# EAGLE schematic ECG_Circuit (EAGLE 8.5.0)
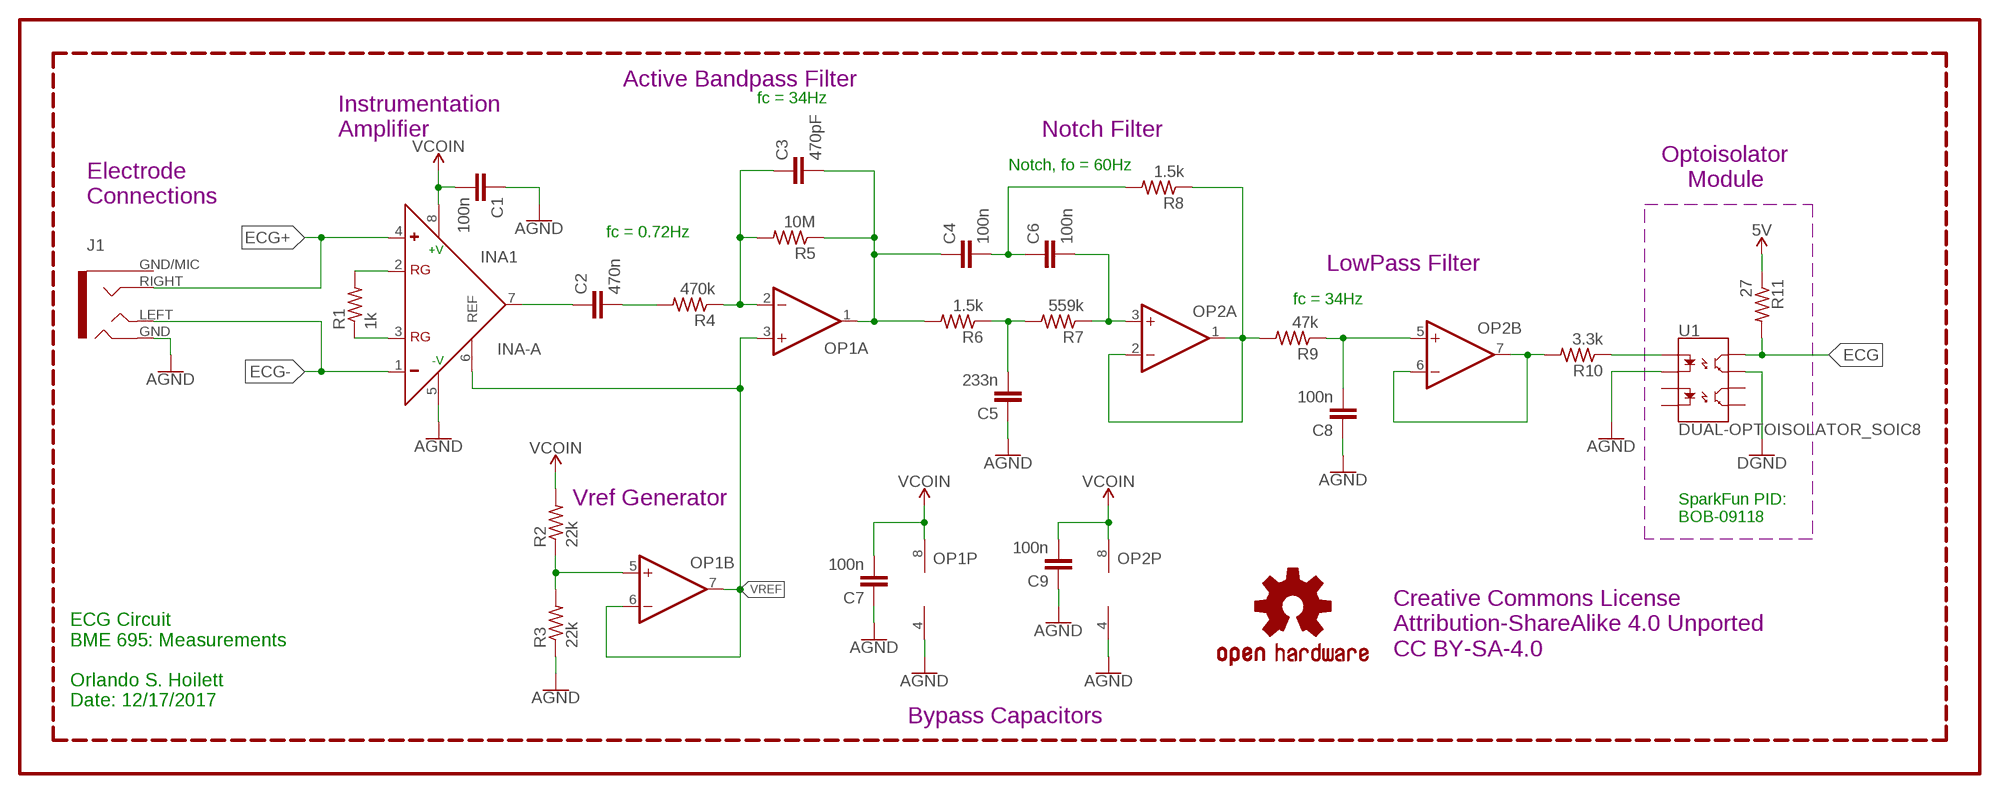
[diagram p0: schematic, sheet 1]

## Parts
C1  100n  CAPACITOR0402  [C0402]
C2  470n  CAPACITOR0402  [C0402]
C3  470pF  CAPACITOR0402  [C0402]
C4  100n  CAPACITOR0402  [C0402]
C5  233n  CAPACITOR0402  [C0402]
C6  100n  CAPACITOR0402  [C0402]
C7  100n  CAPACITOR0402  [C0402]
C8  100n  CAPACITOR0402  [C0402]
C9  100n  CAPACITOR0402  [C0402]
INA1  INA-A  [MSOP08]
J1  AUDIO_JACK_TRRSSMD_RA  [AUDIO_JACK_3.5MM_TRRS_SMD_RA]
LOGO1  OSHW-LOGOS  [OSHW-LOGO-S]
OP1  OP-DUALRM  [MSOP08]
OP2  OP-DUALRM  [MSOP08]
R1  1k  RESISTOR0402  [R0402]
R2  22k  RESISTOR0402  [R0402]
R3  22k  RESISTOR0402  [R0402]
R4  470k  RESISTOR0402  [R0402]
R5  10M  RESISTOR0402  [R0402]
R6  1.5k  RESISTOR0402  [R0402]
R7  559k  RESISTOR0402  [R0402]
R8  1.5k  RESISTOR0402  [R0402]
R9  47k  RESISTOR0402  [R0402]
R10  3.3k  RESISTOR0402  [R0402]
R11  27  RESISTOR0402  [R0402]
U1  DUAL-OPTOISOLATOR_SOIC8  [SO08]

## Nets
5V: R11.1
AGND: C1.1 C5.1 C7.1 C8.1 C9.1 INA1.5(-V) J1.GND(RING2) OP1.4(P:V-) OP2.4(P:V-) R3.1 U1.2(C1)
ECG: OP2.6(B:-IN) OP2.7(B:OUT) R10.2 R11.2 U1.8(CL1)
ECG+: INA1.4(IN+) J1.RIGHT(RING1)
ECG-: INA1.1(IN-) J1.LEFT(TIP)
GND: U1.7(EM1) ; supply symbol labelled DGND
INA: C2.1 INA1.7(OUT)
N$1: C6.2 OP2.3(A:+IN) R7.1
N$2: C5.2 R6.1 R7.2
N$3: OP1.5(B:+IN) R2.1 R3.2
N$4: C2.2 R4.2
N$5: C3.1 OP1.2(A:-IN) R4.1 R5.2
N$6: C8.2 OP2.5(B:+IN) R9.1
N$7: R10.1 U1.1(A1)
N$8: C4.2 C6.1 R8.2
N$9: OP2.1(A:OUT) OP2.2(A:-IN) R8.1 R9.2
N$10: INA1.2(RG) R1.2
N$11: INA1.3(RG) R1.1
OUT: C3.2 C4.1 OP1.1(A:OUT) R5.1 R6.2
V_BATT: C1.2 C7.2 C9.2 INA1.8(+V) OP1.8(P:V+) OP2.8(P:V+) R2.2 ; supply symbol labelled VCOIN
VREF: INA1.6(REF) OP1.3(A:+IN) OP1.6(B:-IN) OP1.7(B:OUT)
Unconnected: J1.GND/MIC(SLEEVE) U1.3(A2) U1.4(C2) U1.5(EM2) U1.6(CL2)

## Notes on the sheet
- Active Bandpass Filter
- fc = 34Hz
- Instrumentation
  Amplifier
- Notch Filter
- Notch, fo = 60Hz
- Optoisolator
      Module
- Electrode
  Connections
- fc = 0.72Hz
- LowPass Filter
- fc = 34Hz
- Vref Generator
- SparkFun PID:
  BOB-09118
- Creative Commons License
  Attribution-ShareAlike 4.0 Unported
  CC BY-SA-4.0
- ECG Circuit
  BME 695: Measurements
  
  Orlando S. Hoilett
  Date: 12/17/2017
- Bypass Capacitors

## Library data of the parts
C1-C9 = CalvEngIO-Passives:CAPACITOR
INA1 = CalvEngIO-AnalogIC:INA-A: Generic symbol and footprint for single supply instrumentation amplifier Fits AD8220, AD8226, AD8227, and others Source: http://www.analog.com/media/en/technical-documentation/data-sheets/AD8227.pdf
J1 = CalvEngIO-Connectors:AUDIO_JACK_TRRS: Audio Jack - 3.5mm TRRS (SMD) This is a 3.5mm TRRS SMD audio jack. TRRS connectors are the audio-style connectors that you see on some phones, MP3 players and development boards. TRRS stands for “tip, ring, ring, sleeve,” which reflects that this has three conductors and a ground. SparkFun Products: Audio Jack <https://www.sparkfun.com/products/12639> mbed Starter Kit <https://www.sparkfun.com/products/12968> SparkFun TRRS 3.5mm Jack Breakout <https://www.sparkfun.com/products/11570>; PROD_ID: CONN-10676; SF_ID: PRT-12639
LOGO1 = SparkFun-Aesthetics:OSHW-LOGO: Open-Source Hardware (OSHW) Logo This logo indicates the piece of hardware it is found on incorporates a OSHW license and/or adheres to the definition of open source hardware found here: http://freedomdefined.org/OSHW
OP1 OP2 = CalvEngIO-AnalogIC:OP-DUAL: Precision Micropower, Low Noise CMOS, Rail-to-Rail Input/Output Operational Amplifiers Source: http://www.analog.com/static/imported-files/data_sheets/AD8603_8607_8609.pdf; MF: ALTERA CORPORATION; MPN: AD8607ARMZ-REEL; OC_FARNELL: 1464990; OC_NEWARK: 59K6925
R1-R11 = CalvEngIO-Passives:RESISTOR
U1 = SparkFun-DiscreteSemi:DUAL-OPTOISOLATOR: Optocoupler, Phototransistor Output, Dual Channel Optically coupled pairs with a gallium arsenide infrared LED and a silicon NPN phototransistor. Signal information, including a DC level, can be transmitted by the device while maintaining a high degree of electrical isolation between input and output. Datasheet <https://www.sparkfun.com/datasheets/Components/SMD/ild205t.pdf> SparkFun Products: SparkFun Opto-isolator Breakout <https://www.sparkfun.com/products/9118>; PROD_ID: IC-09076